# Altium schematic sheet current_sensor_transformer.SchDoc
size A4
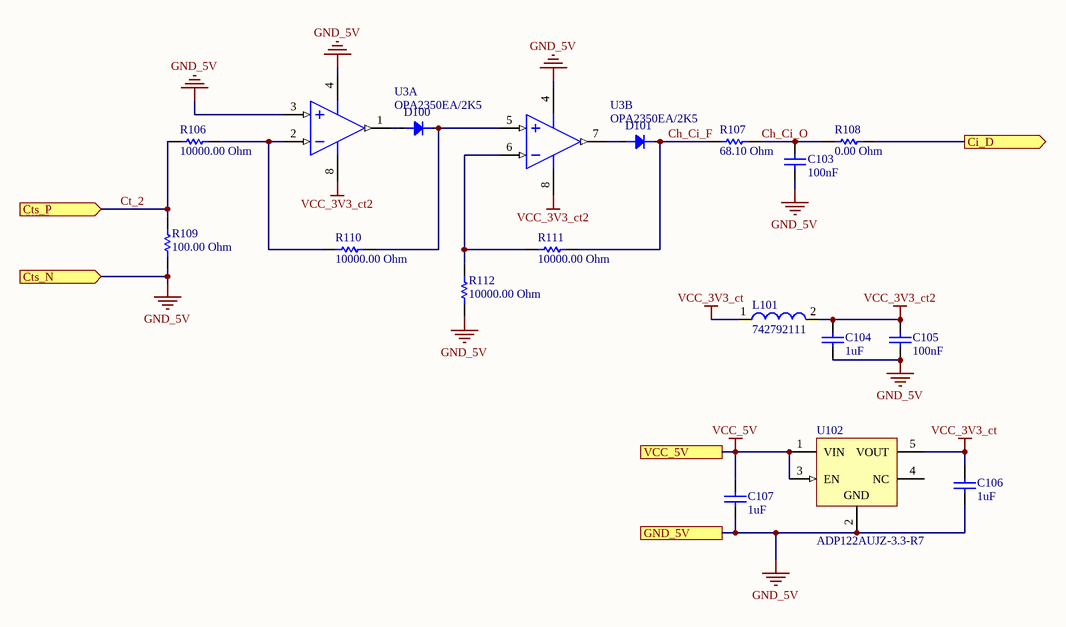
[diagram p0: current_sensor_transformer.SchDoc]

## Parts
C103  value 100nF  [CAPC0603(1608)100_L]  (hidden comment: CAP 100nF 10V 0603(1608))
C104  value 1uF  [CAPC0603(1608)100_L]  (hidden comment: CAP 1uF 50V 0603(1608))
C105  value 100nF  [CAPC0603(1608)100_L]  (hidden comment: CAP 100nF 10V 0603(1608))
C106  value 1uF  [CAPC0603(1608)100_N]  (hidden comment: CAP 1uF 50V 0603(1608))
C107  value 1uF  [CAPC0603(1608)100_N]  (hidden comment: CAP 1uF 50V 0603(1608))
D100  NRVB120VLSFT1G  [NRVB120VLSFT1G]  (value not drawn)
D101  NRVB120VLSFT1G  [NRVB120VLSFT1G]  (value not drawn)
L101  742792111  [SMD-1206]
R106  10000.00 Ohm  [RESC1609X55X30LL15T15]
R107  value 68.10 Ohm  [RESC0805(2012)_L]  (hidden comment: 68R1 1% 0805(2012))
R108  value 0.00 Ohm  [RESC0603(1608)_L]  (hidden comment: Jumper 0603(1608))
R109  100.00 Ohm  [RESC1005X40X25NL05T05]
R110  10000.00 Ohm  [RESC1609X55X30LL15T15]
R111  10000.00 Ohm  [RESC1609X55X30LL15T15]
R112  10000.00 Ohm  [RESC1609X55X30LL15T15]
U3  OPA2350EA/2K5  [DGK0008A_N]  (parts A,B of 2)
U102  ADP122AUJZ-3.3-R7  [ADI-UJ-5_L]

## Ports
Ci_D (out), Cts_N (in), Cts_P (in), GND_5V, VCC_5V

## Nets
GND_5V: C103.1 C104.1 C105.1 C106.1 C107.1 R109.1 R112.2 U3.3(IN_A+) U3.4(V-) U102.2(GND) ; port GND_5V, port Cts_N
VCC_3V3_ct: C106.2 L101.1 U102.5(VOUT)
VCC_3V3_ct2: C104.2 C105.2 L101.2 U3.8(V+)
VCC_5V: C107.2 U102.1(VIN) U102.3(EN) ; port VCC_5V
Ch_Ci_F: D101.2 R107.2 R111.2
Ch_Ci_O: C103.2 R107.1 R108.2
Ci_D: R108.1 ; port Ci_D
Ct_2: R106.2 R109.2 ; port Cts_P
NetD100_1: D100.1 U3.1(OUT_A)
NetD100_2: D100.2 R110.1 U3.5(IN_B+)
NetD101_1: D101.1 U3.7(OUT_B)
NetR106_1: R106.1 R110.2 U3.2(IN_A-)
NetR111_1: R111.1 R112.1 U3.6(IN_B-)

Not connected (* = marked no-connect by the designer): U102 4(NC)

## Library data of the parts
C103 C105 = CMP-1035-02580-1: CAP 100nF 10V ±10% 0603 (1608 Metric) Thickness 1mm SMD; Tolerance: Â±10%; Case-EIA: 0603; Case-Metric: 1608; Max Thickness: 1 mm; Rated Voltage: 10 V; Technology: SMT
C104 C106 C107 = CMP-1035-02746-1: CAP 1uF 50V ±20% 0603 (1608 Metric) Thickness 1mm SMD; Tolerance: Â±20%; Case-EIA: 0603; Case-Metric: 1608; Technology: SMT; Max Thickness: 1 mm; Rated Voltage: 50 V
D100 D101 = NRVB120VLSFT1G: REEL / AUTO STANDARD OF MBR120VL; Manufacturer: ON Semiconductor; Max Reverse Voltage (DC): 20V; Element Configuration: Single; Average Rectified Current: 1A; Peak Reverse Current: 15mA; Peak Non-Repetitive Surge Current: 45A; Supplier 1: Digi-Key; Manufacturer Part Number: NRVB120VLSFT1G; Stock 1: 5674; Pricing 1: 1 = 0.43000, 10 = 0.36700, 25 = 0.34240, 100 = 0.25430, 250 = 0.24156, 500 = 0.19854, 1000 = 0.16137 (USD); RoHS: Yes; Mount: Surface Mount; Case/Package: SOD; Number of Pins: 2; Min Operating Temperature: -65°C; Max Operating Temperature: 125°C; Packaging: Tape and Reel; Max Repetitive Reverse Voltage (Vrrm): 20V; Lead Free: Lead Free; ComponentLink1URL: http://www.mouser.com/ds/2/308/MBR120VLSFT1-D-1074021.pdf?src-supplier=Mouser; ComponentLink1Description: http://www.mouser.com/ds/2/308/MBR120VLSFT1-D-1074021.pdf?src-supplier=Mouser; ComponentLink2URL: http://www.farnell.com/datasheets/2028665.pdf?src-supplier=Farnell; ComponentLink2Description: http://www.farnell.com/datasheets/2028665.pdf?src-supplier=Farnell; ComponentLink3URL: http://www.onsemi.com/pub/Collateral/MBR120VLSFT1-D.PDF?src-supplier=Avnet; ComponentLink3Description: http://www.onsemi.com/pub/Collateral/MBR120VLSFT1-D.PDF?src-supplier=Avnet; ComponentLink4URL: http://www.farnell.com/datasheets/2028665.pdf?src-supplier=Element14; ComponentLink4Description: http://www.farnell.com/datasheets/2028665.pdf?src-supplier=Element14; ComponentLink5URL: http://www.onsemi.com/pub/Collateral/MBR120VLSFT1-D.PDF?src-supplier=Digi-Key; ComponentLink5Description: http://www.onsemi.com/pub/Collateral/MBR120VLSFT1-D.PDF?src-supplier=Digi-Key; ComponentLink6URL: http://www.farnell.com/datasheets/2028665.pdf?src-supplier=Newark; ComponentLink6Description: http://www.farnell.com/datasheets/2028665.pdf?src-supplier=Newark; Supplier Part Number 1: NRVB120VLSFT1GOSCT-ND
L101 = CMP-0220-00024-1: SMD EMI Suppression Ferrite Bead WE-CBF, Z = 26 Ohm; Impedance: 26 Ohm; ComponentLink2Description: Datasheet; PackageReference: SMD-1206; ComponentLink2URL: http://www.we-online.de/katalog/media/pdf/742792111.pdf; PackageVersion: 2007; DatasheetVersion: Dec-2005; PackageDescription: Chip Inductor, 2-Leads, Body 3.2 x 1.6 mm; ComponentLink1URL: http://www.we-online.com; ComponentLink1Description: Manufacturer Link
R106 R110-R112 = CMP-2000-07452-1: Chip Resistor, 10 KOhm, +/- 1%, 0.1 W, -55 to 155 degC, 0603 (1608 Metric), RoHS, Tape and Reel; Manufacturer: Panasonic; Voltage Rating: 75V; Case\/Package: 0603; Power Rating: 100mW; Resistance: 10KOhm; Temperature Coefficient: 100ppm\/degreesC; Number of Pins: 2; Package Reference: 603; Depth: 0.8mm; Mount: SurfaceMount; Package Description: 2-Pin Surface Mount Device, Body 1.6 x 0.85 mm; Datasheet Version: 02/2017; Length: 1.6mm; Lead Free: LeadFree; Height: 0.45mm; Number of Terminations: 2; Max Power Dissipation: 100mW; Min Operating Temperature: -55degC; Datasheet URL: https://industrial.panasonic.com/cdbs/www-data/pdf/RDA0000/AOA0000C304.pdf; Termination: SMD/SMT; Case Code (Metric): 1608; Case Code (Imperial): 0603; Tolerance: 1%; Max Operating Temperature: 155degC; RoHSCompliant: true; Voltage Rating (DC): 75V; Radiation Hardening: No; Packaging: TapeandReel; Composition: ThickFilm; Mounting Technology: SurfaceMount; Manufacturer URL: http://www.panasonic.com/; Width: 0.031inch; REACH SVHC: NoSVHC; Contact Plating: Tin; Military Standard: Not; Package Quantity: 1
R107 = CMP-1013-00379-1: 68R1 0.125W 1% 0805 (2012 Metric)  SMD; Case-EIA: 0805; Case-Metric: 2012; Power: 0.125 W; Tolerance: 1 %; Technology: SMT
R108 = CMP-1012-00001-1: Jumper 0603 (1608 Metric); Case-Metric: 1608; Power: None; Case-EIA: 0603; Technology: SMT; Tolerance: None
R109 = CMP-2002-08127-1: Part Number: CRCW0402100RFKED; Manufacturer: Vishay Dale
U3 = OPA2350EA/2K5: High-Speed, Single-Supply, Rail-to-Rail Operational Amplifier MicroAmplifier(TM) Series, 2.7 to 5.5 V, -40 to 85 degC, 8-pin SOP (DGK8), Green (RoHS & no Sb/Br); Manufacturer: Texas Instruments; Vn at 1kHz(Typ)(nV/rtHz): 18; Iq per channel(Max)(mA): 8.5; Sub Family: Low Input Bias Current Amp (<=10pA), Low Offset Voltage Amplifier (<=500uV), Low Supply Voltage Amplifier (<=2.7V), Precision Amplifier; CMRR(Min)(dB): 74; Total Supply Voltage(Min)(+5V is 5, +/-5V is 10): 2.7; Offset Drift(Typ)(uV/C): 4; Total Supply Voltage(Max)(+5V is 5, +/-5V is 10): 5.5; Number of Channels: 2; Slew Rate(Typ)(V/us): 22; IIB(Max)(pA): 10; Vio (25C)(Max)(mV): 1; ComponentLink1Description: Manufacturer URL; ComponentLink2URL: http://www.ti.com/general/docs/lit/getliterature.tsp?genericPartNumber=OPA2350&fileType=pdf; PackageDescription: 8-Pin Thin Small Outline, Body 3 x 3 mm, Pitch 0.65 mm; ComponentLink2Description: Datasheet; PackageReference: DGK0008A; PartNumber: OPA2350EA/2K5; Mounting Technology: Surface Mount; ComponentLink3Description: Package Specification; DatasheetVersion: SBOS099C; Code_JEDEC: MO-187; Eco-Plan: Green (RoHS & no Sb/Br); ComponentLink3URL: http://www.ti.com/litv/pdf/mpds028d; ComponentLink1URL: http://www.ti.com/; PackageVersion: 4073329/E, 05/2006; Supplier 1: Digi-Key; Supplier 2: Digi-Key; Supplier 3: Digi-Key; Supplier 4: Mouser; Supplier 5: Farnell; Supplier 6: Newark; Supplier Part Number 6: 28AH4511; Supplier Part Number 5: 3004918; Supplier Part Number 4: 595-OPA2350EA/2K5; Supplier Part Number 3: 296-39117-2-ND; Supplier Part Number 2: 296-39117-6-ND; Supplier Part Number 1: 296-39117-1-ND
U102 = CMP-0786-00346-1: 300 mA, Low Quiescent Current, CMOS Linear Regulator, 2.3 to 5.5 V Vin, 3.3 V Vout, Industrial, 5-pin SOT23 (UJ-5), Reel; Manufacturer: Analog Devices; Vin (min) (V): 2.3; Supply Current IGND @ Small Load: 45uA; Vin (max) (V): 5.5; Iout max: 300mA; Preset Vout Values (V): 3.3; ComponentLink4Description: URL Link1; ComponentLink4URL: Product URL:http://www.analog.com/en/ADP122/productSearch.html; ComponentLink2URL: http://www.analog.com/static/imported-files/data_sheets/ADP122_123.pdf; PackageDescription: 5-Pin Thin Small Outline Transistor Package, Body 2.9 x 1.6 mm, Pitch 0.95 mm; ComponentLink1URL: http://www.analog.com/en/index.html; ComponentLink3URL: http:/www.analog.com/static/imported-files/packages/PKG_PDF/TSOT(UJ)/UJ_5.pdf; ComponentLink2Description: Datasheet; PartNumber: ADP122AUJZ-3.3-R7; Packing: Reel; ComponentLink1Description: Manufacturer URL; Code_JEDEC: MO-193-AB; PackageVersion: 100708-A, 10/2008; PackageReference: UJ-5; Mounting Technology: Surface Mount; DatasheetVersion: Rev. E; ComponentLink3Description: Package Specification